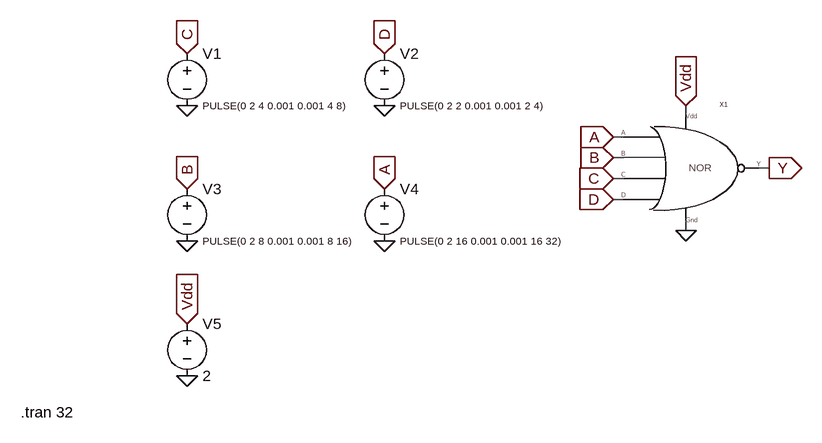
[diagram p0: schematic 4NOR symbol.asc]
4NOR symbol.asc, the LTspice schematic file:
Version 4
SHEET 1 880 680
WIRE 640 16 640 0
WIRE 544 48 528 48
WIRE 544 80 528 80
WIRE 768 96 752 96
WIRE 544 112 528 112
WIRE 544 144 528 144
WIRE 640 192 640 176
FLAG -128 336 Vdd
IOPIN -128 336 In
FLAG 176 -80 D
IOPIN 176 -80 In
FLAG -128 -80 C
IOPIN -128 -80 In
FLAG -128 128 B
IOPIN -128 128 In
FLAG -128 416 0
FLAG 176 208 0
FLAG -128 208 0
FLAG -128 0 0
FLAG 176 0 0
FLAG 176 128 A
IOPIN 176 128 In
FLAG 528 48 A
IOPIN 528 48 In
FLAG 528 80 B
IOPIN 528 80 In
FLAG 528 112 C
IOPIN 528 112 In
FLAG 528 144 D
IOPIN 528 144 In
FLAG 640 0 Vdd
IOPIN 640 0 In
FLAG 640 192 0
FLAG 768 96 Y
IOPIN 768 96 Out
SYMBOL voltage -128 -96 R0
WINDOW 3 24 96 Left 1
WINDOW 123 0 0 Left 0
WINDOW 39 0 0 Left 0
SYMATTR Value PULSE(0 2 4 0.001 0.001 4 8)
SYMATTR InstName V1
SYMBOL voltage 176 -96 R0
WINDOW 3 24 96 Left 1
WINDOW 123 0 0 Left 0
WINDOW 39 0 0 Left 0
SYMATTR Value PULSE(0 2 2 0.001 0.001 2 4)
SYMATTR InstName V2
SYMBOL voltage -128 112 R0
WINDOW 3 24 96 Left 1
WINDOW 123 0 0 Left 0
WINDOW 39 0 0 Left 0
SYMATTR Value PULSE(0 2 8 0.001 0.001 8 16)
SYMATTR InstName V3
SYMBOL voltage 176 112 R0
WINDOW 3 24 96 Left 1
WINDOW 123 0 0 Left 0
WINDOW 39 0 0 Left 0
SYMATTR Value PULSE(0 2 16 0.001 0.001 16 32)
SYMATTR InstName V4
SYMBOL voltage -128 320 R0
WINDOW 123 0 0 Left 0
WINDOW 39 0 0 Left 0
SYMATTR InstName V5
SYMATTR Value 2
SYMBOL 4nor 512 80 R0
SYMATTR InstName X1
TEXT -384 472 Left 2 !.tran 32

The netlist it stands for:
* 4NOR symbol.asc
V1 C 0 PULSE(0 2 4 0.001 0.001 4 8)
V2 D 0 PULSE(0 2 2 0.001 0.001 2 4)
V3 B 0 PULSE(0 2 8 0.001 0.001 8 16)
V4 A 0 PULSE(0 2 16 0.001 0.001 16 32)
V5 Vdd 0 2
XX1 Vdd 0 A B C D Y 4nor  ; pins Vdd Gnd A B C D Y
.tran 32
.backanno
.end

* Results of the author's LTspice run, read from the files saved beside the schematic
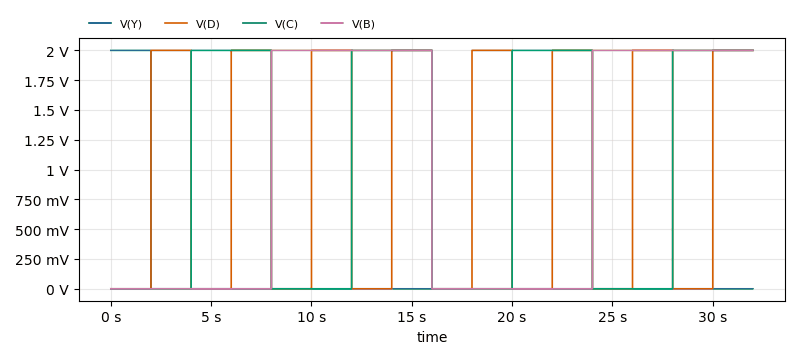
[diagram p1: Transient Analysis of 4NOR symbol.asc, plotted from the saved traces]
* Transient Analysis, 1 run:
*   V(Y): min 401 nV, max 2 V, average 125 mV, rms 500.1 mV, last 401 nV
*   V(D): min 0 V, max 2 V, average 1 V, rms 1.414 V, last 2 V
*   V(C): min 0 V, max 2 V, average 1 V, rms 1.414 V, last 2 V
*   V(B): min 0 V, max 2 V, average 1 V, rms 1.414 V, last 2 V